# Altium schematic sheet UI.SchDoc
size A; SheetNumber: 3; SheetTotal: 10
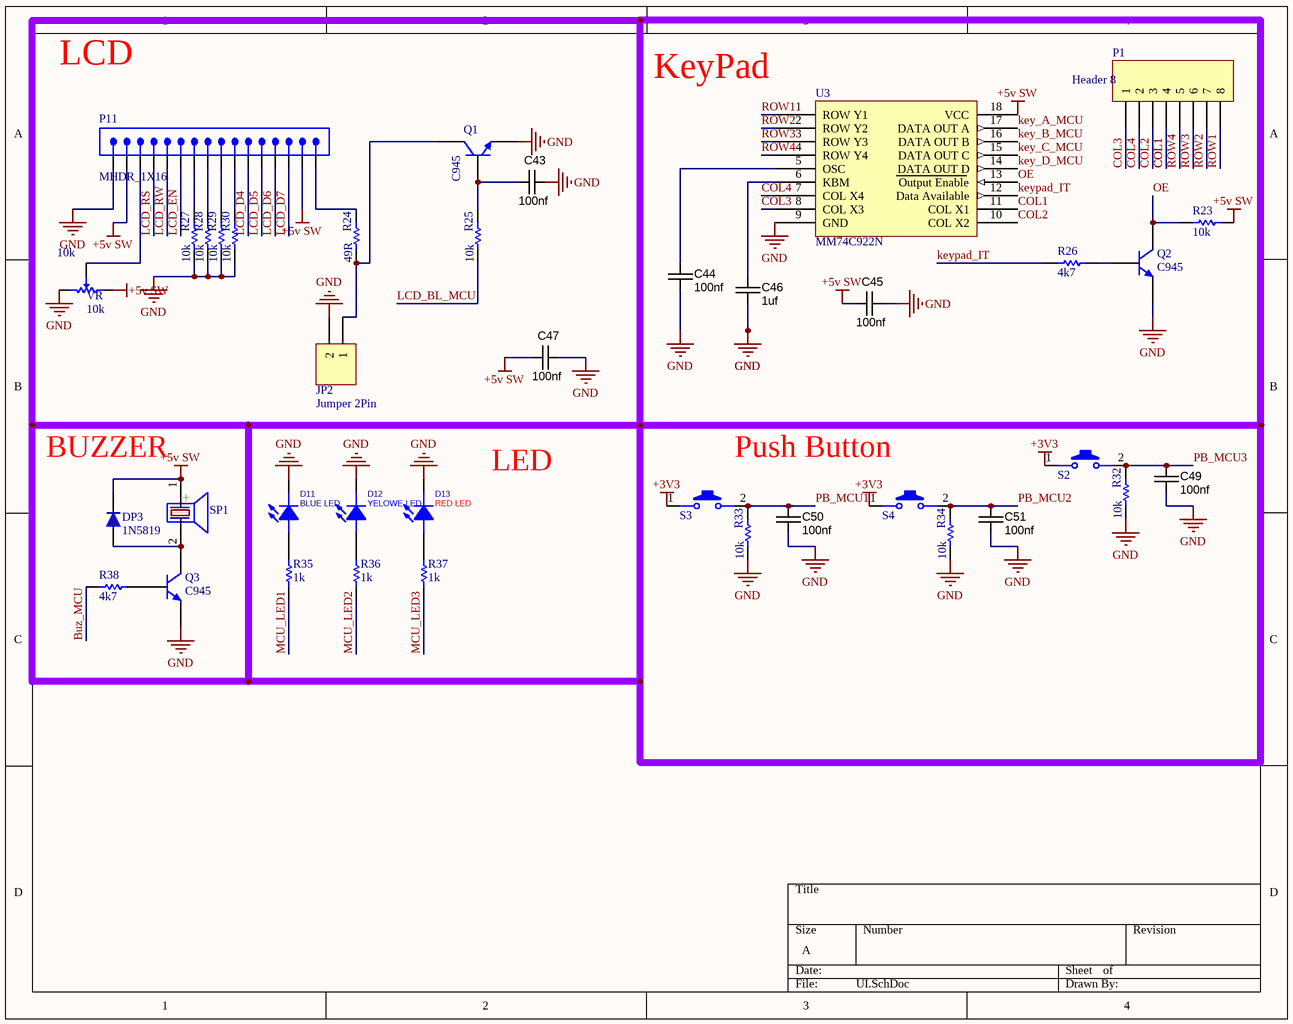
[diagram p0: UI.SchDoc]

## Parts
C43  100nf  [CAPC1608X90N]
C44  100nf  [CAPC1608X90N]
C45  100nf  [CAPC1608X90N]
C46  1uf  [CAPC1608X90N]
C47  100nf  [CAPC1608X90N]
C49  100nf  [CAPC1608X90N]
C50  100nf  [CAPC1608X90N]
C51  100nf  [CAPC1608X90N]
D11  BLUE LED  [LED5MM_BLUE]
D12  YELOWE LED  [LED5MM_YELLOW]
D13  RED LED  [LED5MM_RED]
DP3  1N5819  [430X270D]
JP2  Jumper 2Pin  [Jumper Small - 2.54 - Blue]
P1  Header 8  [HDR1X8]
P11  MHDR_1X16  [MHDR1X16-254P]
Q1  C945  [SOT23_N]
Q2  C945  [SOT23_N]
Q3  C945  [SOT23_N]
R23  10k  [Resistor_SMD_0603 (1608)]
R24  49R  [Resistor_SMD_0603 (1608)]
R25  10k  [Resistor_SMD_0603 (1608)]
R26  4k7  [Resistor_SMD_0603 (1608)]
R27  10k  [Resistor_SMD_0603 (1608)]
R28  10k  [Resistor_SMD_0603 (1608)]
R29  10k  [Resistor_SMD_0603 (1608)]
R30  10k  [Resistor_SMD_0603 (1608)]
R32  10k  [Resistor_SMD_0603 (1608)]
R33  10k  [Resistor_SMD_0603 (1608)]
R34  10k  [Resistor_SMD_0603 (1608)]
R35  1k  [Resistor_SMD_0603 (1608)]
R36  1k  [Resistor_SMD_0603 (1608)]
R37  1k  [Resistor_SMD_0603 (1608)]
R38  4k7  [Resistor_SMD_0603 (1608)]
S2  SW_PB2  [THT_ALPS_SKQKAJD010]  (value not drawn)
S3  SW_PB2  [THT_ALPS_SKQKAJD010]  (value not drawn)
S4  SW_PB2  [THT_ALPS_SKQKAJD010]  (value not drawn)
SP1  (no value)  [BUZZER 7.62mm DC]
U3  MM74C922N  [DIP18]
VR  10k  [Multi Turn]

## Nets
+3V3: S2.1(Button) S3.1(Button) S4.1(Button)
+5v SW: C45.1 C47.1 DP3.2 P11.2 P11.15 R23.1 SP1.1(+) U3.18(VCC) VR.1(CCW)
GND: C43.2 C44.2 C45.2 C46.2 C47.2 C49.1 C50.1 C51.1 D11.2(CATHODE) D12.2(CATHODE) D13.2(CATHODE) JP2.2 P11.1 Q1.2(E) Q2.2(E) Q3.2(E) R27.2 R28.2 R29.2 R30.2 R32.2 R33.2 R34.2 U3.9(GND) VR.2(CW)
Buz_MCU: R38.1
COL1: P1.4 U3.11(COL_X1)
COL2: P1.3 U3.10(COL_X2)
COL3: P1.1 U3.8(COL_X3)
COL4: P1.2 U3.7(COL_X4)
key_A_MCU: U3.17(DATA_OUT_A)
key_B_MCU: U3.16(DATA_OUT_B)
key_C_MCU: U3.15(DATA_OUT_C)
key_D_MCU: U3.14(DATA_OUT_D)
keypad_IT: R26.1 U3.12(Data_Available)
LCD_BL_MCU: R25.2
LCD_D4: P11.11
LCD_D5: P11.12
LCD_D6: P11.13
LCD_D7: P11.14
LCD_EN: P11.6
LCD_RS: P11.4
LCD_RW: P11.5
MCU_LED1: R35.1
MCU_LED2: R36.1
MCU_LED3: R37.1
OE: Q2.3(C) R23.2 U3.13(Output_Enable)
PB_MCU1: C50.2 R33.1 S3.2
PB_MCU2: C51.2 R34.1 S4.2
PB_MCU3: C49.2 R32.1 S2.2
ROW1: P1.8 U3.1(ROW_Y1)
ROW2: P1.7 U3.2(ROW_Y2)
ROW3: P1.6 U3.3(ROW_Y3)
ROW4: P1.5 U3.4(ROW_Y4)
NetC43_1: C43.1 Q1.1(B) R25.1
NetC44_1: C44.1 U3.5(OSC)
NetC46_1: C46.1 U3.6(KBM)
NetD11_1: D11.1(ANODE) R35.2
NetD12_1: D12.1(ANODE) R36.2
NetD13_1: D13.1(ANODE) R37.2
NetDP3_1: DP3.1 Q3.3(C) SP1.2(-)
NetJP2_1: JP2.1 Q1.3(C) R24.2
NetP11_3: P11.3 VR.3(Setpoint)
NetP11_7: P11.7 R27.1
NetP11_8: P11.8 R28.1
NetP11_9: P11.9 R29.1
NetP11_10: P11.10 R30.1
NetP11_16: P11.16 R24.1
NetQ2_1: Q2.1(B) R26.2
NetQ3_1: Q3.1(B) R38.2

## Notes on the sheet
- LCD
- KeyPad
- BUZZER
- LED
- Push Button

## Library data of the parts
C43-C47 C49-C51 = CAPC_100n_0603_X7R_50V_10%: Capacitor SMD Cer 100nF 10% 50V X7R 0603; Manufacturer 1: AVX Corporation; Manufacturer Part Number 1: 06035C104KAT2A; Ratings: 50V; X7R; Material: ceramic; SCDType: spec; Value: 100n; Manufacturer 2: TDK Corporation; Manufacturer Part Number 2: C1608X7R1H104K; Package / Case: 0603 (1608 Metric); Tolerance: ±10%; Supplier 1: Digi-Key; Supplier Part Number 1: 478-5052-1-ND; ComponentLink1URL: http://www.avx.com/docs/Catalogs/cx7r.pdf; ComponentLink1Description: http://www.avx.com/docs/Catalogs/cx7r.pdf; Supplier 2: Digi-Key; Supplier Part Number 2: 445-1314-1-ND; ComponentLink2URL: http://product.tdk.com/capacitor/mlcc/en/documents/mlcc_commercial_general_en.pdf; ComponentLink2Description: http://product.tdk.com/capacitor/mlcc/en/documents/mlcc_commercial_general_en.pdf
D11-D13 = LED5MM: LED LIGHTING; Designer: Abbas Basereh; Data: 16-12-2016; Link: *; Part.No: *
DP3 = 1N5819: Schottkey Rectifiers; Designer: Abbas Basereh; Data: 16-12-2016; Link: *; Part. No: *
JP2 = Jumper 2Pin: Jumper, 2-Pin; Designer: Abbas Basereh; Data: 16-12-2016; Link: *
P1 = Header 8: Header, 8-Pin; LatestRevisionDate: 17-Jul-2002; LatestRevisionNote: Re-released for DXP Platform.; Publisher: Altium Limited
P11 = MHDR_1X16: Male Header 1X16
Q1-Q3 = C945: NPN Silicon Epitaxial Planar Transistor; Published: 2017-2-8; LatestRevisionDate: 2017; LatestRevisionNote: IPC-7351 Footprint Added.; DatasheetVersion: 2017; PackageVersion: 2017-2-8; PackageReference: SOT23; Publisher: Abbas Basereh; PackageDescription: 3-Pin SOT-23 Package 0.95 mm Pitch, 2.3 mm Lead Span; ComponentLink1Description: Manufacturer Link; ComponentLink1URL: http://www.taitroncomponents.com/; ComponentLink2Description: Datasheet; ComponentLink2URL: http://www.taitroncomponents.com/
R23 R25 R27-R30 R32-R34 = Resistor: Resistor 0603; Email: razi.vesali@gmail.com; Published: 17-Jun-2016; LatestRevisionNote: Re-released for puplic; Publisher: Seyed Razi Vesali; Value: 10k
R24 R26 R35-R38 = Resistor: Resistor 0603; Email: razi.vesali@gmail.com; Value: 10k; Published: 17-Jun-2016; LatestRevisionNote: Re-released for puplic; Publisher: Seyed Razi Vesali
S2-S4 = SW_PB2: 2 Pin Push Button Switch; Company: SJ Libraries; Designer: Eng. Saeid Jorablo; Mounting Technology: Surface Mount\Through-Hole; ComponentLink1Description: Datasheet; Pin Count: 0; Update Date: 6/3/2012; Category: MISC; HelpURL: http://s3.picofile.com/file/7443264187/Coming_Soon_logo.gif
SP1 = PIEZO BUZZER: PIEZO BUZZER ACTIVE; Designer: Abbas Basereh; Comment_1: SPEAKER AND BEEP; Design Date: 1395/11/14; ComponentLink2Description: Reference; PackageDescription: THD; Publisher: Abbas Basereh; Mounting Technology: THD; Pin Count: 2; Status: Unreleased
U3 = MM74c922N_Fairchild: 16-Key Encoder
VR = Multi Turn: Email: Razi.vesali@gmail.com; LatestRevisionDate: 17-Jul-2016; LatestRevisionNote: Re-released for Puplic; Publisher: Seyed Razi vesali (SRV); Value: 10k